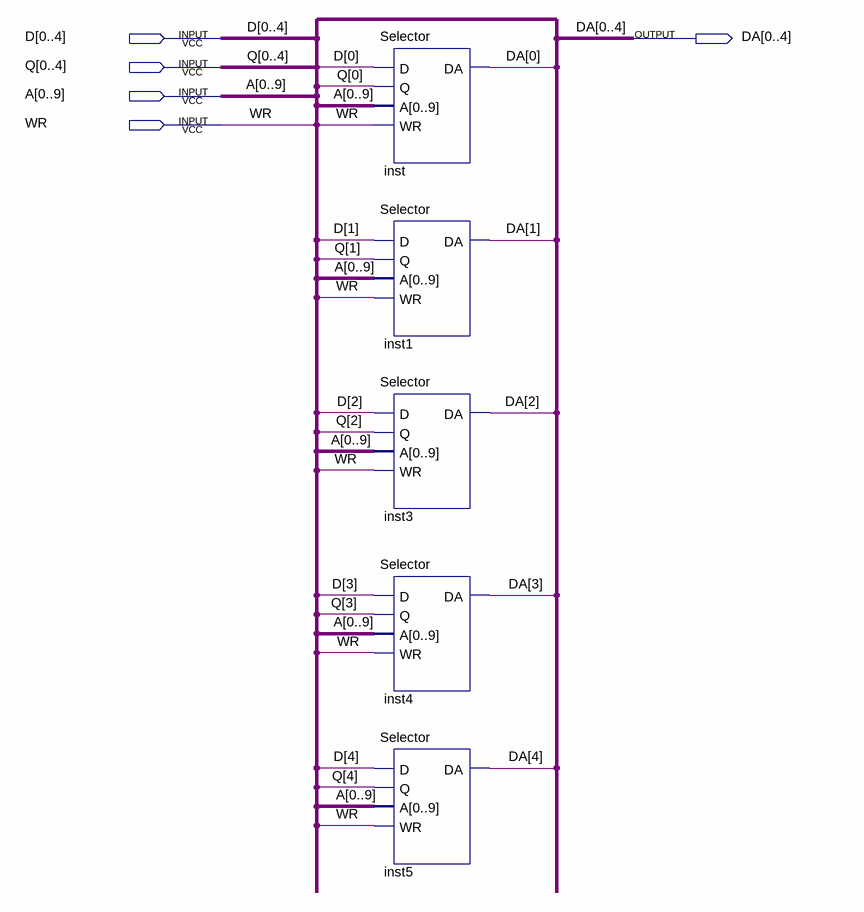
[diagram p0: schematic sheet]
// Quartus schematic Selector5.bdf as structural Verilog: 5 symbols, 5 pins
module Selector5 (
  input  [0:4] D,
  input  [0:4] Q,
  input  [0:9] A,
  input  WR,
  output [0:4] DA
);

  Selector inst (.D(D[0]), .Q(Q[0]), .A(A), .WR(WR), .DA(DA[0]));
  Selector inst1 (.D(D[1]), .Q(Q[1]), .A(A), .WR(WR), .DA(DA[1]));
  Selector inst3 (.D(D[2]), .Q(Q[2]), .A(A), .WR(WR), .DA(DA[2]));
  Selector inst4 (.D(D[3]), .Q(Q[3]), .A(A), .WR(WR), .DA(DA[3]));
  Selector inst5 (.D(D[4]), .Q(Q[4]), .A(A), .WR(WR), .DA(DA[4]));
endmodule
